# Altium schematic sheet main.SchDoc
size A2
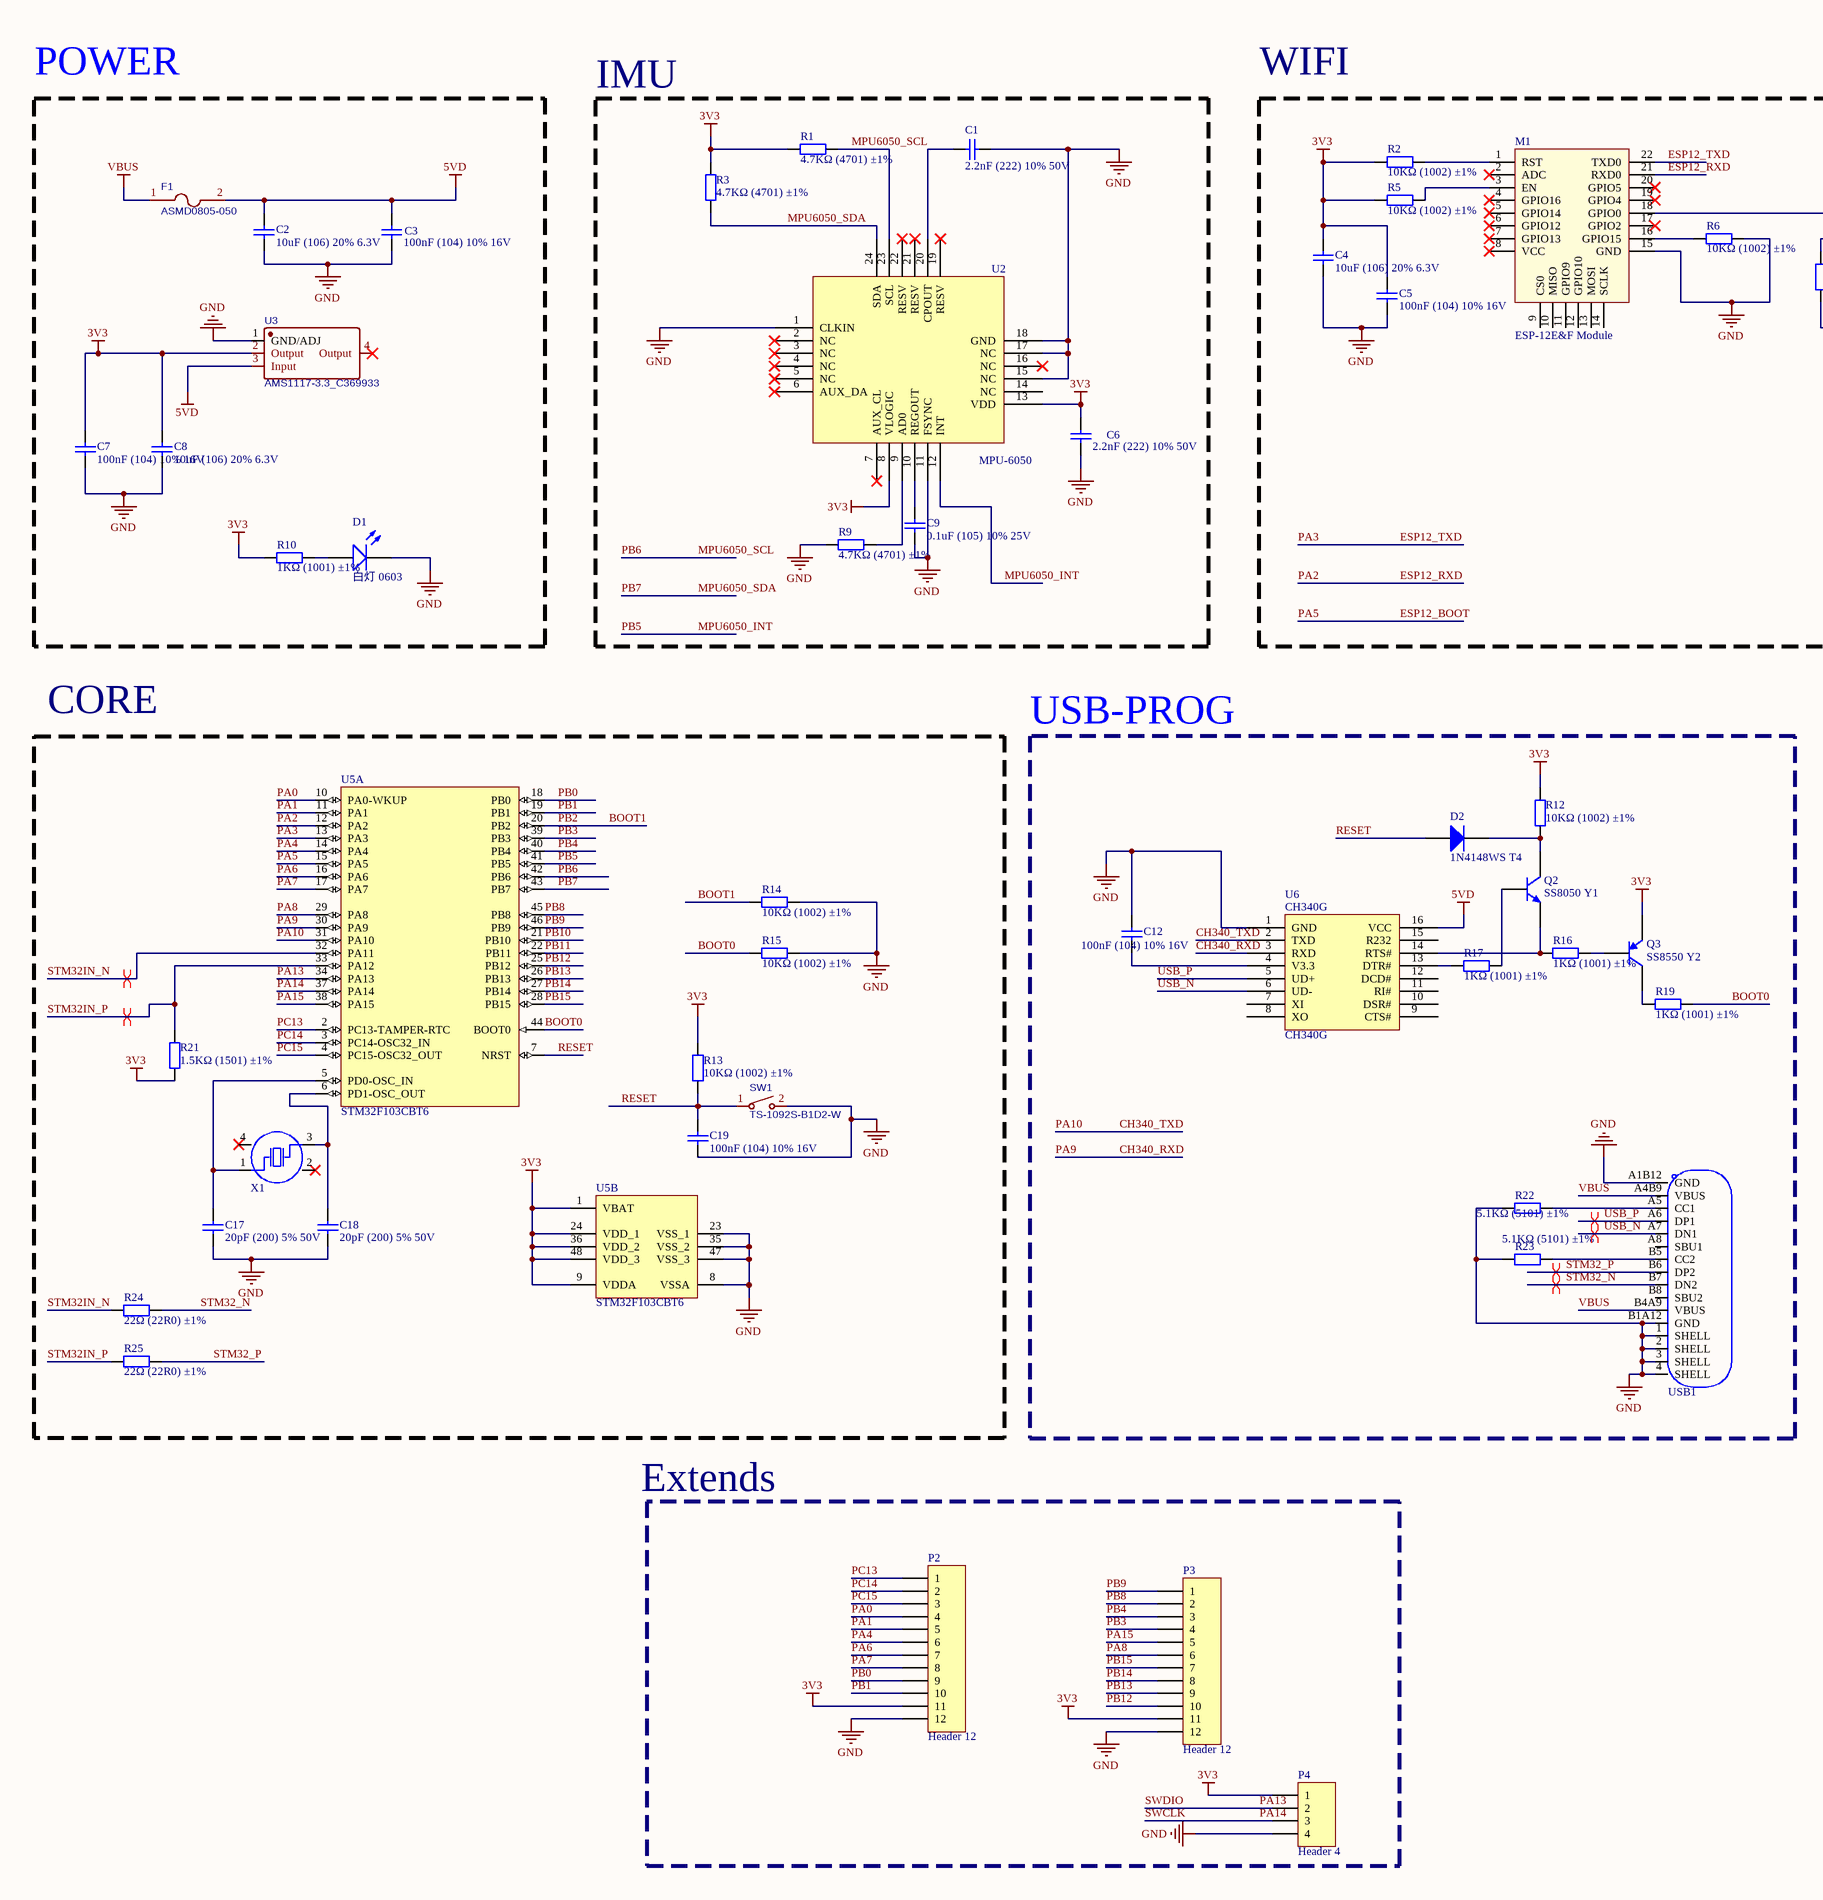
[diagram p0: main.SchDoc, left]
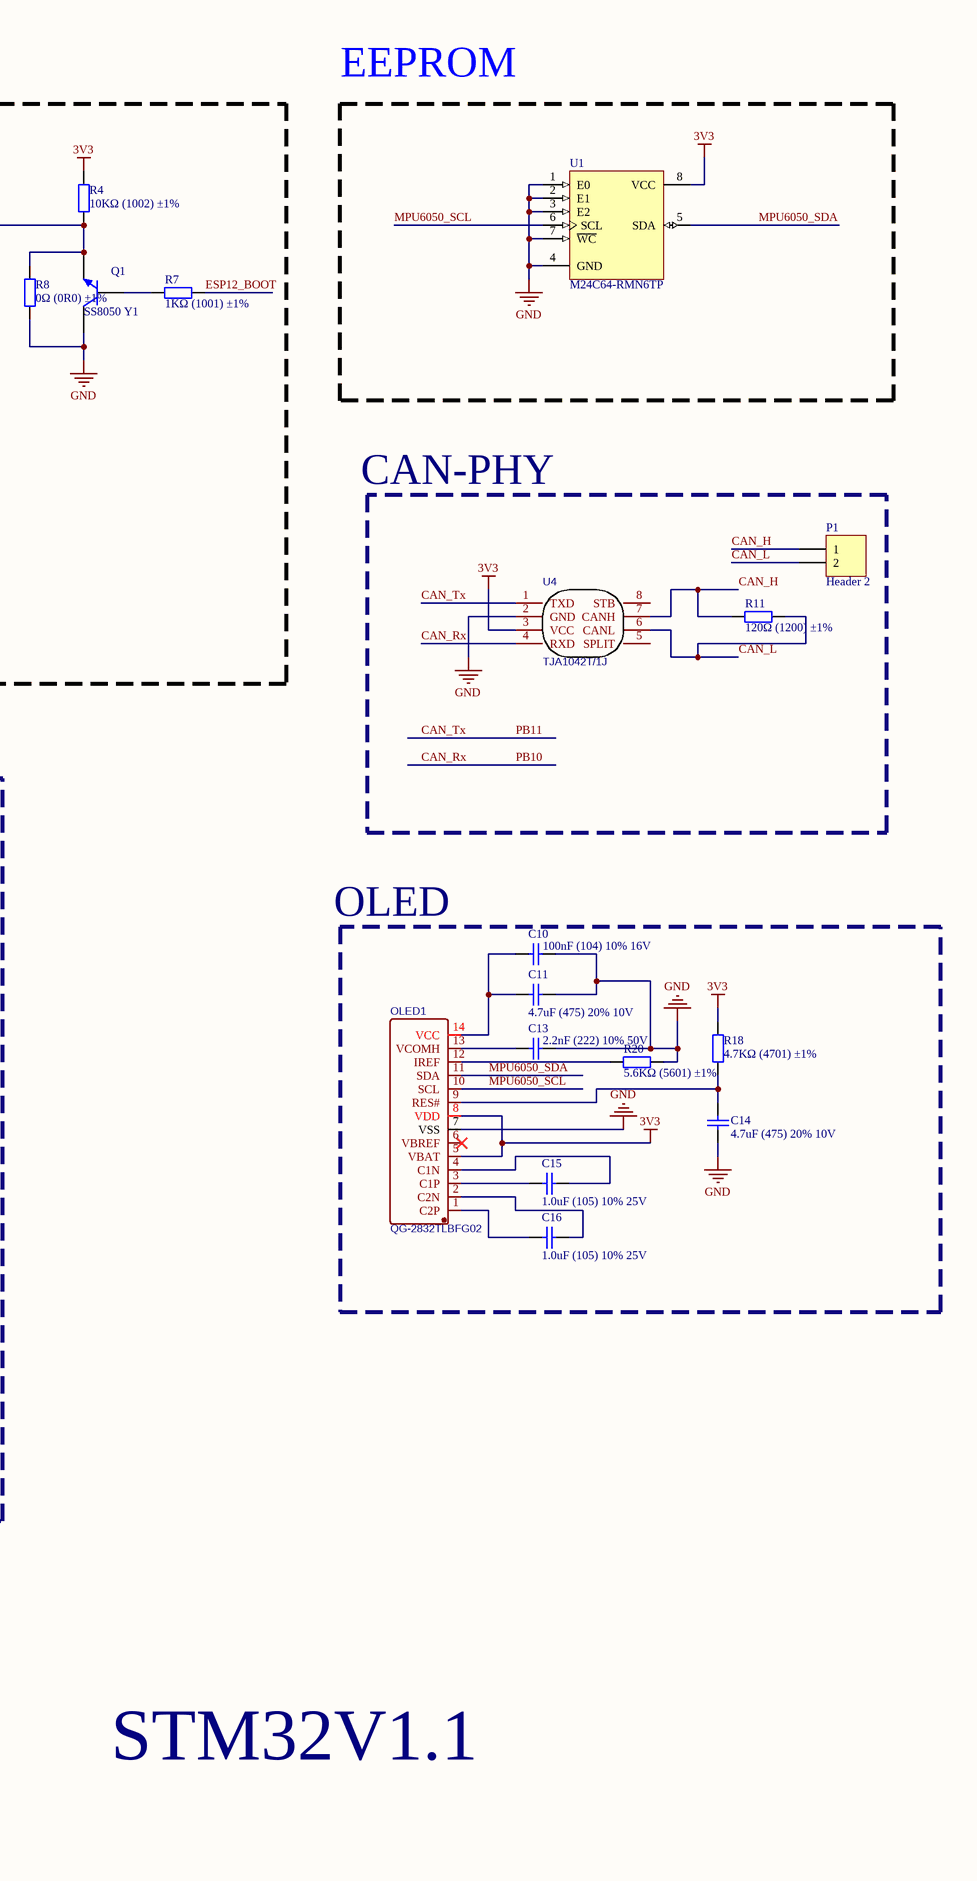
[diagram p1: main.SchDoc, right]

## Parts
C1  2.2nF (222) 10% 50V  [0402_C]
C2  10uF (106) 20% 6.3V  [0402_C]
C3  100nF (104) 10% 16V  [0402_C]
C4  10uF (106) 20% 6.3V  [0402_C]
C5  100nF (104) 10% 16V  [0402_C]
C6  2.2nF (222) 10% 50V  [0402_C]
C7  100nF (104) 10% 16V  [0402_C]
C8  10uF (106) 20% 6.3V  [0402_C]
C9  0.1uF (105) 10% 25V  [0402_C]
C10  100nF (104) 10% 16V  [0402_C]
C11  4.7uF (475) 20% 10V  [0402_C]
C12  100nF (104) 10% 16V  [0402_C]
C13  2.2nF (222) 10% 50V  [0402_C]
C14  4.7uF (475) 20% 10V  [0402_C]
C15  1.0uF (105) 10% 25V  [0402_C]
C16  1.0uF (105) 10% 25V  [0402_C]
C17  20pF (200) 5% 50V  [0402_C]
C18  20pF (200) 5% 50V  [0402_C]
C19  100nF (104) 10% 16V  [0402_C]
D1  白灯 0603  [0603_LED_S1]
D2  1N4148WS T4  [SOD-323_L1.8-W1.3-LS2.5-RD]
F1  ASMD0805-050  [ASMD0805]
M1  ESP-12E&F Module  [ESP-12E&F Module]
OLED1  QG-2832TLBFG02  [OLED-SMD_QG-9616TSWCG02]
P1  Header 2  [HDR1X2]
P2  Header 12  [HDR1X12]
P3  Header 12  [HDR1X12]
P4  Header 4  [HDR1X4]
Q1  SS8050 Y1  [SOT-23(SOT-23-3)]
Q2  SS8050 Y1  [SOT-23(SOT-23-3)]
Q3  SS8550 Y2  [SOT-23(SOT-23-3)]
R1  4.7KΩ (4701) ±1%  [0402_R]
R2  10KΩ (1002) ±1%  [0402_R]
R3  4.7KΩ (4701) ±1%  [0402_R]
R4  10KΩ (1002) ±1%  [0402_R]
R5  10KΩ (1002) ±1%  [0402_R]
R6  10KΩ (1002) ±1%  [0402_R]
R7  1KΩ (1001) ±1%  [0402_R]
R8  0Ω (0R0) ±1%  [0402_R]
R9  4.7KΩ (4701) ±1%  [0402_R]
R10  1KΩ (1001) ±1%  [0402_R]
R11  120Ω (1200) ±1%  [0402_R]
R12  10KΩ (1002) ±1%  [0402_R]
R13  10KΩ (1002) ±1%  [0402_R]
R14  10KΩ (1002) ±1%  [0402_R]
R15  10KΩ (1002) ±1%  [0402_R]
R16  1KΩ (1001) ±1%  [0402_R]
R17  1KΩ (1001) ±1%  [0402_R]
R18  4.7KΩ (4701) ±1%  [0402_R]
R19  1KΩ (1001) ±1%  [0402_R]
R20  5.6KΩ (5601) ±1%  [0402_R]
R21  1.5KΩ (1501) ±1%  [0402_R]
R22  5.1KΩ (5101) ±1%  [0402_R]
R23  5.1KΩ (5101) ±1%  [0402_R]
R24  22Ω (22R0) ±1%  [0402_R]
R25  22Ω (22R0) ±1%  [0402_R]
SW1  TS-1092S-B1D2-W  [SW-SMD_L6.1-W3.6-LS7.9]
U1  M24C64-RMN6TP  [SOIC-8_150mil]
U2  MPU-6050  [QFN-24_4x4x05P]
U3  AMS1117-3.3_C369933  [SOT-223-AMS1117]
U4  TJA1042T/1J  [SOIC-8_L5.0-W4.0-P1.27-LS6.0-BL]
U5  STM32F103CBT6  [STM-LQFP48_N]  (parts A,B of 2)
U6  CH340G  [SOIC-16_150mil]
USB1  TYPE-C16PIN  [TYPE-C-SMD]  (value not drawn)
X1  8MHZ  [OSC-SMD_4P-L5.0-W3.2-BL]  (value not drawn)

## Blocks framed on the sheet
POWER: C2 C3 C7 C8 D1 F1 R10 U3
IMU: C1 C6 C9 R1 R3 R9 U2
WIFI: C4 C5 M1 Q1 R2 R4-R8
CORE: C17-C19 R13-R15 R21 R24 R25 SW1 U5 X1

## Nets
3V3: C4.2 C5.2 C6.2 C7.2 C8.2 OLED1.5(VBAT) OLED1.8(VDD) P2.11 P3.11 P4.1 Q3.2(E) R1.1 R2.1 R3.2 R4.2 R5.1 R10.1 R12.2 R13.2 R18.2 R21.1 U1.8(VCC) U2.8(VLOGIC) U2.13(VDD) U3.2(Output) U4.3(VCC) U5.1(VBAT) U5.9(VDDA) U5.24(VDD_1) U5.36(VDD_2) U5.48(VDD_3)
5VD: C2.2 C3.2 F1.2 U3.3(Input) U6.16(VCC)
GND: C1.2 C2.1 C3.1 C4.1 C5.1 C6.1 C7.1 C8.1 C9.1 C10.2 C11.2 C12.2 C13.1 C14.1 C17.1 C18.1 C19.1 D1.K M1.15(GND) OLED1.7(VSS) P2.12 P3.12 P4.4 Q1.3(C) R6.2 R8.1 R9.2 R14.2 R15.2 R20.2 R22.1 R23.1 SW1.2 U1.1(E0) U1.2(E1) U1.3(E2) U1.4(GND) U1.7(~{WC}) U2.1(CLKIN) U2.11(FSYNC) U2.15(NC) U2.17(NC) U2.18(GND) U3.1(GND/ADJ) U4.2(GND) U5.8(VSSA) U5.23(VSS_1) U5.35(VSS_2) U5.47(VSS_3) U6.1(GND) USB1.1(SHELL) USB1.2(SHELL) USB1.3(SHELL) USB1.4(SHELL) USB1.A1B12(GND) USB1.B1A12(GND)
VBUS: F1.1 USB1.A4B9(VBUS) USB1.B4A9(VBUS)
BOOT0: R15.1 R19.1 U5.44(BOOT0)
BOOT1: R14.1 U5.20(PB2)  [also labelled PB2]
CAN_H: P1.1 R11.1 U4.7(CANH)
CAN_L: P1.2 R11.2 U4.6(CANL)
CAN_Rx: U4.4(RXD) U5.21(PB10)  [also labelled PB10]
CAN_Tx: U4.1(TXD) U5.22(PB11)  [also labelled PB11]
CH340_RXD: U5.30(PA9) U6.3(RXD)  [also labelled PA9]
CH340_TXD: U5.31(PA10) U6.2(TXD)  [also labelled PA10]
ESP12_BOOT: R7.2 U5.15(PA5)  [also labelled PA5]
ESP12_RXD: M1.21(RXD0) U5.12(PA2)  [also labelled PA2]
ESP12_TXD: M1.22(TXD0) U5.13(PA3)  [also labelled PA3]
MPU6050_INT: U2.12(INT) U5.41(PB5)  [also labelled PB5]
MPU6050_SCL: OLED1.10(SCL) R1.2 U1.6(SCL) U2.23(SCL) U5.42(PB6)  [also labelled PB6]
MPU6050_SDA: OLED1.11(SDA) R3.1 U1.5(SDA) U2.24(SDA) U5.43(PB7)  [also labelled PB7]
PA0: P2.4 U5.10(PA0-WKUP)
PA1: P2.5 U5.11(PA1)
PA4: P2.6 U5.14(PA4)
PA6: P2.7 U5.16(PA6)
PA7: P2.8 U5.17(PA7)
PA8: P3.6 U5.29(PA8)
PA13: P4.2 U5.34(PA13)  [also labelled SWDIO]
PA14: P4.3 U5.37(PA14)  [also labelled SWCLK]
PA15: P3.5 U5.38(PA15)
PB0: P2.9 U5.18(PB0)
PB1: P2.10 U5.19(PB1)
PB3: P3.4 U5.39(PB3)
PB4: P3.3 U5.40(PB4)
PB8: P3.2 U5.45(PB8)
PB9: P3.1 U5.46(PB9)
PB12: P3.10 U5.25(PB12)
PB13: P3.9 U5.26(PB13)
PB14: P3.8 U5.27(PB14)
PB15: P3.7 U5.28(PB15)
PC13: P2.1 U5.2(PC13-TAMPER-RTC)
PC14: P2.2 U5.3(PC14-OSC32_IN)
PC15: P2.3 U5.4(PC15-OSC32_OUT)
RESET: C19.2 D2.1(A) R13.1 SW1.1 U5.7(NRST)
STM32_N: R24.2 USB1.B7(DN2)
STM32_P: R25.2 USB1.B6(DP2)
STM32IN_N: R24.1 U5.32(PA11)
STM32IN_P: R21.2 R25.1 U5.33(PA12)
USB_N: U6.6(UD-) USB1.A7(DN1)
USB_P: U6.5(UD+) USB1.A6(DP1)
NetC1_1: C1.1 U2.20(CPOUT)
NetC9_2: C9.2 U2.10(REGOUT)
NetC10_1: C10.1 C11.1 OLED1.14(VCC)
NetC12_1: C12.1 U6.4(V3.3)
NetC13_2: C13.2 OLED1.13(VCOMH)
NetC14_2: C14.2 OLED1.9(RES#) R18.1
NetC15_1: C15.1 OLED1.4(C1N)
NetC15_2: C15.2 OLED1.3(C1P)
NetC16_1: C16.1 OLED1.2(C2N)
NetC16_2: C16.2 OLED1.1(C2P)
NetC17_2: C17.2 U5.5(PD0-OSC_IN) X1.1(OSC1)
NetC18_2: C18.2 U5.6(PD1-OSC_OUT) X1.3(OSC2)
NetD1_A: D1.A R10.2
NetD2_2: D2.2(K) Q2.3(C) R12.1
NetM1_1: M1.1(RST) R2.2
NetM1_3: M1.3(EN) R5.2
NetM1_16: M1.16(GPIO15) R6.1
NetM1_18: M1.18(GPIO0) Q1.2(E) R4.1 R8.2
NetOLED1_12: OLED1.12(IREF) R20.1
NetQ1_1: Q1.1(B) R7.1
NetQ2_1: Q2.1(B) R17.2
NetQ2_2: Q2.2(E) R16.1 U6.14(RTS#)
NetQ3_1: Q3.1(B) R16.2
NetQ3_3: Q3.3(C) R19.2
NetR9_1: R9.1 U2.9(AD0)
NetR17_1: R17.1 U6.13(DTR#)
NetR22_2: R22.2 USB1.A5(CC1)
NetR23_2: R23.2 USB1.B5(CC2)

Not connected (* = marked no-connect by the designer): M1 2(ADC)* 4(GPIO16)* 5(GPIO14)* 6(GPIO12)* 7(GPIO13)* 8(VCC)* 9(CS0) 10(MISO) 11(GPIO9) 12(GPIO10) 13(MOSI) 14(SCLK) 17(GPIO2)* 19(GPIO4)* 20(GPIO5)*; OLED1 6(VBREF)*; U2 2(NC)* 3(NC)* 4(NC)* 5(NC)* 6(AUX_DA)* 7(AUX_CL)* 14(NC) 16(NC)* 19(RESV)* 21(RESV)* 22(RESV)*; U3 4(Output)*; U4 5(SPLIT) 8(STB); U6 7(XI) 8(XO) 9(CTS#) 10(DSR#) 11(RI#) 12(DCD#) 15(R232); USB1 A8(SBU1) B8(SBU2); X1 2(GND)* 4(GND)*

## Layout directives
differential pair: STM32_N, STM32_P, STM32IN_N, STM32IN_P, USB_N, USB_P

## Notes on the sheet
- EEPROM
- CAN-PHY
- USB-PROG
- OLED
- Extends
- STM32V1.1
- Title
- Size:
- Date:
- File:
- A2
- Number:
- Time:
- Revision:
- Sheet
- of

## Library data of the parts
C1 C6 C13 = 0402 2.2nF (222) 10% 50V: 贴片电容; ComponentLink1Description: 供应商链接; ComponentLink1URL: http://www.szlcsc.com/product/details_1883.html; Package: 0402; Supplier: LC; SuppliersPartNumber: C1531
C2 C4 C8 = 0402 10uF (106) 20% 6.3V: 贴片电容; ComponentLink1Description: 供应商链接; ComponentLink1URL: http://www.szlcsc.com/product/details_16204.html; Package: 0402; Supplier: LC; SuppliersPartNumber: C15525
C3 C5 C7 C10 C12 C19 = 0402 100nF (104) 10% 16V: 贴片电容; ComponentLink1Description: 供应商链接; ComponentLink1URL: http://www.szlcsc.com/product/details_1877.html; Package: 0402; Supplier: LC; SuppliersPartNumber: C1525
C9 C15 C16 = 0402 1.0uF (105) 10% 25V: 贴片电容; ComponentLink1Description: 供应商链接; ComponentLink1URL: http://www.szlcsc.com/product/details_53938.html; Package: 0402; Supplier: LC; SuppliersPartNumber: C52923
C11 C14 = 0402 4.7uF (475) 20% 10V: 贴片电容; ComponentLink1Description: 供应商链接; ComponentLink1URL: http://www.szlcsc.com/product/details_24469.html; Package: 0402; Supplier: LC; SuppliersPartNumber: C23733
C17 C18 = 0402 20pF (200) 5% 50V: 贴片电容; ComponentLink1Description: 供应商链接; ComponentLink1URL: http://www.szlcsc.com/product/details_1906.html; Package: 0402; Supplier: LC; SuppliersPartNumber: C1554
D1 = 0603 白灯: 发光二极管; ComponentLink1Description: 供应商链接; ComponentLink1URL: http://www.szlcsc.com/product/details_2663.html; Package: 0603; Supplier: LC; SuppliersPartNumber: C2290
D2 = SOD-323 1N4148WS T4: 二极管; ComponentLink1Description: 供应商链接; ComponentLink1URL: http://www.szlcsc.com/product/details_2485.html; Package: SOD-323; Supplier: LC; SuppliersPartNumber: C2128
F1 = ASMD0805-050: BOM_Manufacturer: JDTFUSE; Contributor: LCSC; BOM_Supplier: LCSC; BOM_Manufacturer Part: ASMD0805-050; BOM_Supplier Part: C135329; BOM_JLCPCB Part Class: Extended Part; spicePre: F; spiceSymbolName: ASMD0805-050
OLED1 = OLED: BOM_Manufacturer: Allvision; Contributor: LCSC; BOM_Supplier: LCSC; BOM_Manufacturer Part: QG-2832TLBFG02; BOM_Supplier Part: C91220; BOM_JLCPCB Part Class: Extended Part; spicePre: O; spiceSymbolName: QG-2832TLBFG02
P1 = Header 2: Header, 2-Pin; LatestRevisionDate: 17-Jul-2002; LatestRevisionNote: Re-released for DXP Platform.; Publisher: Altium Limited
P2 P3 = Header 12: Header, 12-Pin; LatestRevisionDate: 17-Jul-2002; LatestRevisionNote: Re-released for DXP Platform.; Publisher: Altium Limited
P4 = Header 4: Header, 4-Pin; LatestRevisionDate: 17-Jul-2002; LatestRevisionNote: Re-released for DXP Platform.; Publisher: Altium Limited
Q1 Q2 = SOT-23 SS8050 Y1: 三极管; ComponentLink1Description: 供应商链接; ComponentLink1URL: http://www.szlcsc.com/product/details_2507.html; Package: SOT-23; Supplier: LC; SuppliersPartNumber: C2150
Q3 = SOT-23 SS8550 Y2: 三极管; ComponentLink1Description: 供应商链接; ComponentLink1URL: http://www.szlcsc.com/product/details_9037.html; Package: SOT-23; Supplier: LC; SuppliersPartNumber: C8542
R1 R3 R9 R18 = 0402 4.7KΩ (4701) 1%: 贴片电阻; ComponentLink1Description: 供应商链接; ComponentLink1URL: http://www.szlcsc.com/product/details_26643.html; Package: 0402; Supplier: LC; SuppliersPartNumber: C25900
R2 R4-R6 R12-R15 = 0402 10KΩ (1002) 1%: 贴片电阻; ComponentLink1Description: 供应商链接; ComponentLink1URL: http://www.szlcsc.com/product/details_26487.html; Package: 0402; Supplier: LC; SuppliersPartNumber: C25744
R7 R10 R16 R17 R19 = 0402 1KΩ (1001) 1%: 贴片电阻; ComponentLink1Description: 供应商链接; ComponentLink1URL: http://www.szlcsc.com/product/details_12256.html; Package: 0402; Supplier: LC; SuppliersPartNumber: C11702
R8 = 0402 0Ω (0R0) 1%: 贴片电阻; ComponentLink1Description: 供应商链接; ComponentLink1URL: http://www.szlcsc.com/product/details_17853.html; Package: 0402; Supplier: LC; SuppliersPartNumber: C17168
R11 = 0402 120Ω (1200) 1%: 贴片电阻; ComponentLink1Description: 供应商链接; ComponentLink1URL: http://www.szlcsc.com/product/details_25822.html; Package: 0402; Supplier: LC; SuppliersPartNumber: C25079
R20 = 0402 5.6KΩ (5601) 1%: 贴片电阻; ComponentLink1Description: 供应商链接; ComponentLink1URL: http://www.szlcsc.com/product/details_26651.html; Package: 0402; Supplier: LC; SuppliersPartNumber: C25908
R21 = 0402 1.5KΩ (1501) 1%: 贴片电阻; ComponentLink1Description: 供应商链接; ComponentLink1URL: http://www.szlcsc.com/product/details_26610.html; Package: 0402; Supplier: LC; SuppliersPartNumber: C25867
R22 R23 = 0402 5.1KΩ (5101) 1%: 贴片电阻; ComponentLink1Description: 供应商链接; ComponentLink1URL: http://www.szlcsc.com/product/details_26648.html; Package: 0402; Supplier: LC; SuppliersPartNumber: C25905
R24 R25 = 0402 22Ω (22R0) 1%: 贴片电阻; ComponentLink1Description: 供应商链接; ComponentLink1URL: http://www.szlcsc.com/product/details_25835.html; Package: 0402; Supplier: LC; SuppliersPartNumber: C25092
SW1 = TS-1092S-B1D2-W: 触控开关; BOM_Manufacturer: Yuandi(台湾元迪); Contributor: LCSC; BOM_Supplier: LCSC; BOM_Supplier Part: C782859; BOM_Manufacturer Part: TS-1092S-B1D2-W; BOM_JLCPCB Part Class: Extended Part; spicePre: S; spiceSymbolName: TS-1092S-B1D2-W
U1 = M24C64-RMN6TP: EEPROM; ComponentLink1Description: 供应商链接; ComponentLink1URL: http://www.szlcsc.com/product/details_81133.html; Package: SOIC-8_150mil; Supplier: LC; SuppliersPartNumber: C79988
U2 = MPU-6050: 传感器; ComponentLink1Description: 供应商链接; ComponentLink1URL: http://www.szlcsc.com/product/details_24852.html; Package: QFN-24_4x4x05P; Supplier: LC; SuppliersPartNumber: C24112
U3 = AMS1117-3.3: BOM_Manufacturer: KEXIN; Contributor: LCSC; BOM_Paste Type: expand; BOM_Supplier: LCSC; BOM_Supplier Part: C369933; BOM_Manufacturer Part: AMS1117-3.3; spicePre: U; spiceSymbolName: AMS1117-3.3_C369933
U4 = TJA1042T/1J: CAN芯片; BOM_Manufacturer: NXP; BOM_Supplier: LCSC; BOM_Manufacturer Part: TJA1042T/1J; BOM_Supplier Part: C53670; BOM_JLCPCB Part Class: Extended Part; spicePre: U; spiceSymbolName: TJA1042T/1J
U5 = STM32F103CBT6: ARM Cortex-M3 32-bit MCU, 128 KB Flash, 20 KB Internal RAM, 37 I/Os, 48-pin LQFP, -40 to 85 degC, Tray; A/D Converter: 2x12-bit (10 Channel); FLASH Size (Prog) (kB): 128; I/Os (High Current): 37; Internal RAM Size (kB): 20; Operating Frequency(F) (Processor speed) (MHz): 72; Supply Voltage(Vcc) min (V): 2; DatasheetVersion: Rev. 16; PackageVersion: Rev. 6, 06/2013; PackageReference: LQFP48; PackageDescription: 48-Pin Low Profile Quad Flat Package, 7 x 7 mm Body, 0.5 mm Pitch; Supplier 1: Digi-Key; Supplier Part Number 1: 497-6288-ND; Supplier 2: Farnell; Supplier Part Number 2: 1606327; Supplier 3: Newark; Supplier Part Number 3: 11N8296; Supplier 4: Newark; Supplier Part Number 4: 57P1214; Supplier 5: Mouser; Supplier Part Number 5: 511-STM32F103CBT6; Core: ARM Cortex-M3; Packing: Tray; Mounting Technology: Surface Mount; PartNumber: STM32F103CBT6; ComponentLink1Description: Manufacturer URL; ComponentLink1URL: http://www.st.com/web/en/home.html; ComponentLink2Description: Datasheet; ComponentLink2URL: http://www.st.com/st-web-ui/static/active/en/resource/technical/document/datasheet/CD00161566.pdf; ComponentLink3Description: Package Specification; ComponentLink3URL: http://www.st.com/st-web-ui/static/active/en/resource/technical/document/datasheet/DM00058181.pdf
U6 = CH340G_[C14267]: USB; ComponentLink1Description: 供应商链接; ComponentLink1URL: http://www.szlcsc.com/product/details_14927.html; Package: SOIC-16_150mil; Supplier: LC; SuppliersPartNumber: C14267
USB1 = TYPE-C16PIN: Manufacturer: SHOU HAN(首韩); Add into BOM: yes; Connector Type: Type-C; Gender: 母座; Number of Contacts: 16; Number of Ports: 1; Current Rating - Power (Max): 3A; Symbol: TYPE-C16PIN; Device: TYPE-C16PIN; LCSC Part Name: Type-C 母座 卧贴 快充闪充 停产; Supplier Part: C393939; Manufacturer Part: TYPE-C16PIN; Supplier Footprint: SMD; JLCPCB Part Class: Extended Part; Datasheet: https://atta.szlcsc.com/upload/public/pdf/source/20190521/C393939_7B9043D4CF1026AF443AB60D91FBCD5C.pdf; Supplier: LCSC; Convert to PCB: yes; Standard: -; Mounting Style: 卧贴; Operating Temperature Range: -40~+85
X1 = 8MHZ: 8M 30PPM 20pf; Manufacturer: SIWARD(台湾希华); Symbol: XTL541200-C282-030; Add into BOM: yes; Device: XTL541200-C282-030; LCSC Part Name: 8MHz 20pF 20PPM; Supplier Part: C211359; Manufacturer Part: XTL541200-C282-030; Supplier Footprint: SMD5032-4P; JLCPCB Part Class: Extended Part; Datasheet: https://atta.szlcsc.com/upload/public/pdf/source/20180502/C211359_C3A699E12D7D0972204A7F7616890513.pdf; Supplier: LCSC; Convert to PCB: yes; Crystal Type: -; Frequency Tolerance: -; Frequency Stability: -; Load Capacitance: -; Operating Temperature: -